# Altium schematic sheet LOAD.SchDoc
size A2; Author: Van Hieu; Organization: BACH-KHOA-DK; Gmail: maivanhieu24042003@gmail.com
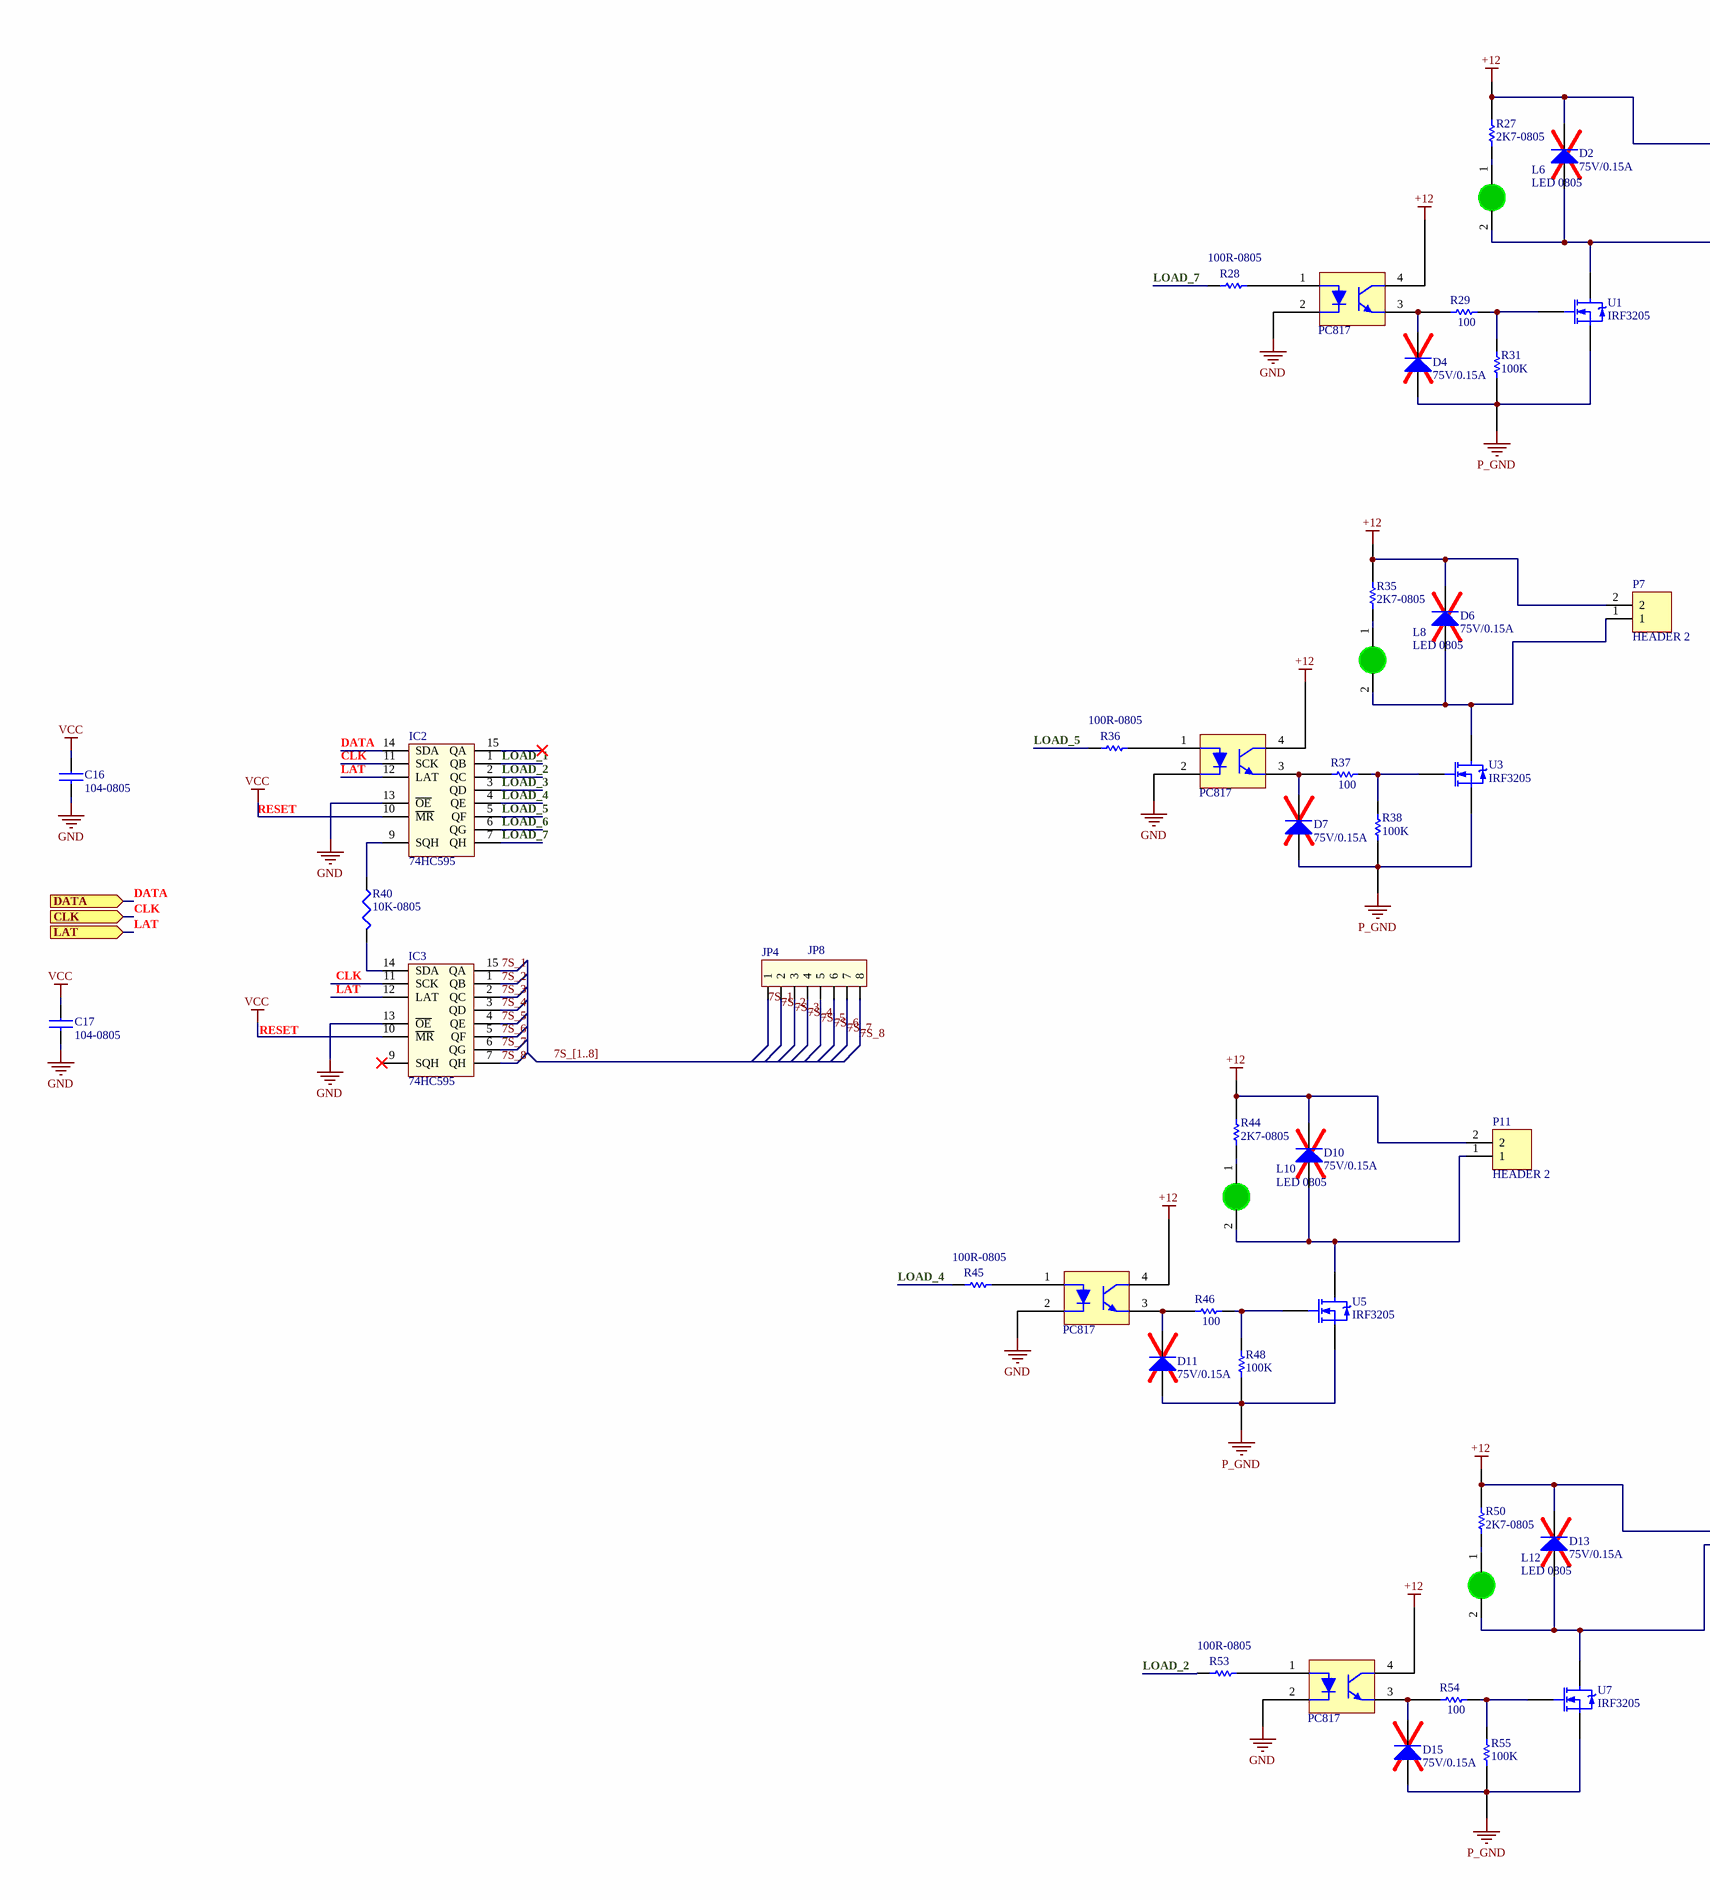
[diagram p0: LOAD.SchDoc, left]
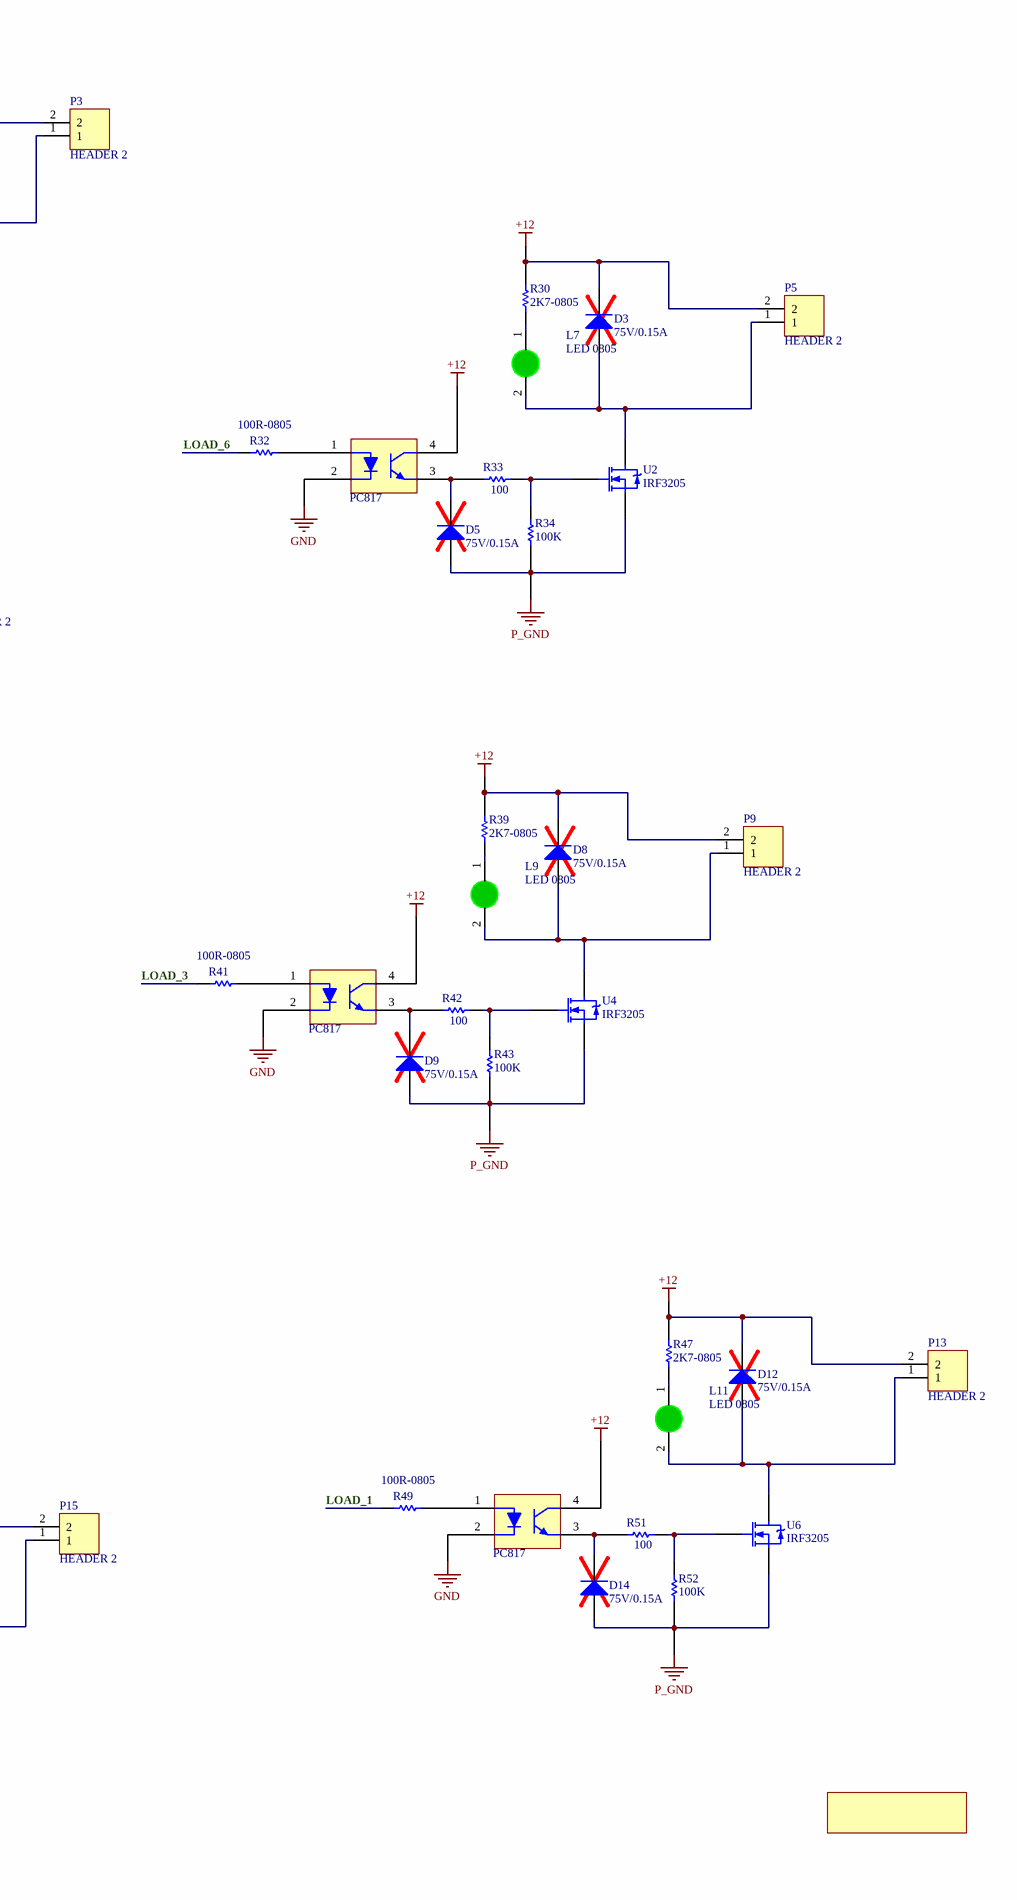
[diagram p1: LOAD.SchDoc, right]

## Parts
C16  104-0805  [CAP0805]
C17  104-0805  [CAP0805]
D2  75V/0.15A  [DIO-SOD232-1.15H]
D3  75V/0.15A  [DIO-SOD232-1.15H]
D4  75V/0.15A  [DIO-SOD232-1.15H]
D5  75V/0.15A  [DIO-SOD232-1.15H]
D6  75V/0.15A  [DIO-SOD232-1.15H]
D7  75V/0.15A  [DIO-SOD232-1.15H]
D8  75V/0.15A  [DIO-SOD232-1.15H]
D9  75V/0.15A  [DIO-SOD232-1.15H]
D10  75V/0.15A  [DIO-SOD232-1.15H]
D11  75V/0.15A  [DIO-SOD232-1.15H]
D12  75V/0.15A  [DIO-SOD232-1.15H]
D13  75V/0.15A  [DIO-SOD232-1.15H]
D14  75V/0.15A  [DIO-SOD232-1.15H]
D15  75V/0.15A  [DIO-SOD232-1.15H]
IC2  74HC595  [HC595_SOP127P600X175-16N]
IC3  74HC595  [HC595_SOP127P600X175-16N]
JP4  JP8  [CON8]
L6  LED 0805  [LED-GREEN-0805]
L7  LED 0805  [LED-GREEN-0805]
L8  LED 0805  [LED-GREEN-0805]
L9  LED 0805  [LED-GREEN-0805]
L10  LED 0805  [LED-GREEN-0805]
L11  LED 0805  [LED-GREEN-0805]
L12  LED 0805  [LED-GREEN-0805]
P3  HEADER 2  [HT508R-2P]
P4  PC817  [DIP-4]
P5  HEADER 2  [HT508R-2P]
P6  PC817  [DIP-4]
P7  HEADER 2  [HT508R-2P]
P8  PC817  [DIP-4]
P9  HEADER 2  [HT508R-2P]
P10  PC817  [DIP-4]
P11  HEADER 2  [HT508R-2P]
P12  PC817  [DIP-4]
P13  HEADER 2  [HT508R-2P]
P14  PC817  [DIP-4]
P15  HEADER 2  [HT508R-2P]
P16  PC817  [DIP-4]
R27  2K7-0805  [RESC2012L]
R28  100R-0805  [RESC2012L]
R29  100  [Res 0805 SMD]
R30  2K7-0805  [RESC2012L]
R31  100K  [Res 0805 SMD]
R32  100R-0805  [RESC2012L]
R33  100  [Res 0805 SMD]
R34  100K  [Res 0805 SMD]
R35  2K7-0805  [RESC2012L]
R36  100R-0805  [RESC2012L]
R37  100  [Res 0805 SMD]
R38  100K  [Res 0805 SMD]
R39  2K7-0805  [RESC2012L]
R40  10K-0805  [RES0805]
R41  100R-0805  [RESC2012L]
R42  100  [Res 0805 SMD]
R43  100K  [Res 0805 SMD]
R44  2K7-0805  [RESC2012L]
R45  100R-0805  [RESC2012L]
R46  100  [Res 0805 SMD]
R47  2K7-0805  [RESC2012L]
R48  100K  [Res 0805 SMD]
R49  100R-0805  [RESC2012L]
R50  2K7-0805  [RESC2012L]
R51  100  [Res 0805 SMD]
R52  100K  [Res 0805 SMD]
R53  100R-0805  [RESC2012L]
R54  100  [Res 0805 SMD]
R55  100K  [Res 0805 SMD]
U1  IRF3205  [TO-220]
U2  IRF3205  [TO-220]
U3  IRF3205  [TO-220]
U4  IRF3205  [TO-220]
U5  IRF3205  [TO-220]
U6  IRF3205  [TO-220]
U7  IRF3205  [TO-220]

## Ports
CLK (in), DATA (in), LAT (in)

## Nets
+12: D2.2(K) D3.2(K) D6.2(K) D8.2(K) D10.2(K) D12.2(K) D13.2(K) P3.2 P4.4 P5.2 P6.4 P7.2 P8.4 P9.2 P10.4 P11.2 P12.4 P13.2 P14.4 P15.2 P16.4 R27.2 R30.2 R35.2 R39.2 R44.2 R47.2 R50.2
GND: C16.2 C17.2 IC2.8(GND) IC2.13(~{OE}) IC3.8(GND) IC3.13(~{OE}) P4.2 P6.2 P8.2 P10.2 P12.2 P14.2 P16.2
P_GND: D4.1(A) D5.1(A) D7.1(A) D9.1(A) D11.1(A) D14.1(A) D15.1(A) R31.1 R34.1 R38.1 R43.1 R48.1 R52.1 R55.1 U1.3(S) U2.3(S) U3.3(S) U4.3(S) U5.3(S) U6.3(S) U7.3(S)
VCC: C16.1 C17.1 IC2.10(~{MR}) IC2.16(VCC) IC3.10(~{MR}) IC3.16(VCC)
7S_1: IC3.15(QA) JP4.1
7S_2: IC3.1(QB) JP4.2
7S_3: IC3.2(QC) JP4.3
7S_4: IC3.3(QD) JP4.4
7S_5: IC3.4(QE) JP4.5
7S_6: IC3.5(QF) JP4.6
7S_7: IC3.6(QG) JP4.7
7S_8: IC3.7(QH) JP4.8
CLK: IC2.11(SCK) IC3.11(SCK) ; port CLK
DATA: IC2.14(SDA) ; port DATA
LAT: IC2.12(LAT) IC3.12(LAT) ; port LAT
LOAD_1: IC2.1(QB) R49.2
LOAD_2: IC2.2(QC) R53.2
LOAD_3: IC2.3(QD) R41.2
LOAD_4: IC2.4(QE) R45.2
LOAD_5: IC2.5(QF) R36.2
LOAD_6: IC2.6(QG) R32.2
LOAD_7: IC2.7(QH) R28.2
NetD2_1: D2.1(A) L6.2(K) P3.1 U1.2(D)
NetD3_1: D3.1(A) L7.2(K) P5.1 U2.2(D)
NetD4_2: D4.2(K) P4.3 R29.2
NetD5_2: D5.2(K) P6.3 R33.2
NetD6_1: D6.1(A) L8.2(K) P7.1 U3.2(D)
NetD7_2: D7.2(K) P8.3 R37.2
NetD8_1: D8.1(A) L9.2(K) P9.1 U4.2(D)
NetD9_2: D9.2(K) P10.3 R42.2
NetD10_1: D10.1(A) L10.2(K) P11.1 U5.2(D)
NetD11_2: D11.2(K) P12.3 R46.2
NetD12_1: D12.1(A) L11.2(K) P13.1 U6.2(D)
NetD13_1: D13.1(A) L12.2(K) P15.1 U7.2(D)
NetD14_2: D14.2(K) P14.3 R51.2
NetD15_2: D15.2(K) P16.3 R54.2
NetIC2_9: IC2.9(SQH) R40.1
NetIC3_14: IC3.14(SDA) R40.2
NetL6_1: L6.1(A) R27.1
NetL7_1: L7.1(A) R30.1
NetL8_1: L8.1(A) R35.1
NetL9_1: L9.1(A) R39.1
NetL10_1: L10.1(A) R44.1
NetL11_1: L11.1(A) R47.1
NetL12_1: L12.1(A) R50.1
NetP4_1: P4.1 R28.1
NetP6_1: P6.1 R32.1
NetP8_1: P8.1 R36.1
NetP10_1: P10.1 R41.1
NetP12_1: P12.1 R45.1
NetP14_1: P14.1 R49.1
NetP16_1: P16.1 R53.1
NetR29_1: R29.1 R31.2 U1.1(G)
NetR33_1: R33.1 R34.2 U2.1(G)
NetR37_1: R37.1 R38.2 U3.1(G)
NetR42_1: R42.1 R43.2 U4.1(G)
NetR46_1: R46.1 R48.2 U5.1(G)
NetR51_1: R51.1 R52.2 U6.1(G)
NetR54_1: R54.1 R55.2 U7.1(G)

Not connected (* = marked no-connect by the designer): IC2 15(QA)*; IC3 9(SQH)*

## Buses and harness runs
bus 7S_[1..8]

## Notes on the sheet
- RESET
- Van Hieu
- Date:
- File:
- Size:
- A3
- Number:
- Time:
- Sheet
- Revision:
- of
- BK-DN
- maivanhieu24042003@gmail.com

## Library data of the parts
C16 C17 = CC0805JRNPO9BN200: Multilayer Ceramic Capacitors MLCC - SMD/SMT 20pF 50V NPO 5%; Manufacturer: Yageo; Type: General Purpose Surface-Mount Ceramic Multilayer Capacitor; Voltage Rating DC: 50 VDC; Class: Class 1; Dielectric: C0G (NP0); Supplier 1: Mouser; Manufacturer Part Number: CC0805JRNPO9BN200; RoHS: RoHS Compliant By Exemption; Category: Multilayer Ceramic Capacitors MLCC - SMD/SMT; Stock 1: 0; Pricing 1: 1=0.100, 10=0.040, 100=0.018, 1000=0.014, 4000=0.013 (USD); Capacitance: 20 pF; Length: 2 mm; Package / Case: 0805 (2012 metric); Packaging: Cut Tape; Product: General Type MLCCs; Series: CC; Termination Style: SMD/SMT; Tolerance: 5 %; Width: 1.25 mm; Brand: Yageo; Case Code - in: 0805; Case Code - mm: 2012; Maximum Operating Temperature: + 125 C; Minimum Operating Temperature: - 55 C; Product Type: Ceramic Capacitors; Standard Pack Qty: 4000; Subcategory: Capacitors; Termination: Standard; RoHS - Mouser: E; Minimum Order Quantity: 1; Reeling: True; ComponentLink1URL: http://www.mouser.com/datasheet/2/447/UPY-GP_NP0_16V-to-50V_16-1109089.pdf; ComponentLink1Description: http://www.mouser.com/datasheet/2/447/UPY-GP_NP0_16V-to-50V_16-1109089.pdf; Supplier Part Number 1: 603-CC805JRNPO9BN200
D2-D15 = 1N4148WS: DIO GEN 75V 0.15A SOD323 SMD; MFR: ONSEMI; UNIT: PCS; MFR PN: 1N4148WS; LINK: NA; PRICE: NA
IC2 IC3 = 74595: 8 Bit Serial input - Parallel Output; Value: 74HC595
JP4 = Con8: Connector 8; Value: Connector 8
L6-L12 = LED GREEN 0805: SMD; Don_Vi: Con; Chung_Loai: Dán; Ma_Hang: MH000897; Ten_Linh_Kien: LED 0805 Màu Đỏ (Red); Ghi_Chu: *; Kieu_Chan: *
P4 P6 P8 P10 P12 P14 P16 = PC817: NPN PHOTO General Purpose Amplifier; Published: 8-Jun-2000; LatestRevisionDate: 15-Jan-2003; LatestRevisionNote: PCB Footprint 'BCY-W3/D4.7' replaced; DatasheetDocument: 1997; PackageReference: TO-92A; Publisher: Altium Limited; Code_JEDEC: TO-92A
R27-R39 R41-R55 = 34.8K/R0805/1%_3: 1 kOhms ±1% 0.125W, 1/8W Chip Resistor 0805 (2012 Metric) Automotive AEC-Q200 Thick Film; Power Rating: 100mW; Resistance: 34.8kR; Voltage Rating: 50V; Case/Package: 0603; Case Code (Imperial): 0603; Case Code (Metric): 1608; Min Operating Temperature: -55°C; Max Operating Temperature: 155°C; Termination: SMD/SMT; Military Standard: Not; Voltage Rating (DC): 50V; Length: 1.6mm; Height: 0.45mm; Width: 0.8mm; Depth: 0.8mm; Lead Free: Lead Free; Digikey: 541-1.00KCCT-ND
R40 = RC0805JR-0710KL: RES SMD 10K OHM 5% 1/8W 0805; Manufacturer: Yageo; Power (Watts): 0.125W, 1/8W; Temperature Coefficient: ±100ppm/°C; Supplier 1: Digi-Key; Manufacturer Part Number: RC0805JR-0710KL; RoHS: RoHS Compliant; Category: Resistors; Stock 1: 0; Pricing 1: 1=0.1, 10=0.036, 100=0.0145, 1000=0.00652, 2500=0.00566 (USD); Packaging: Cut Tape (CT); Part Status: Active; Tolerance: ±5%; Composition: Thick Film; Features: Moisture Resistant; Operating Temperature: -55°C ~ 155°C; Package / Case: 0805 (2012 Metric); Supplier Device Package: 0805; Size / Dimension: 0.079" L x 0.049" W (2.00mm x 1.25mm); Height - Seated (Max): 0.024" (0.60mm); Failure Rate: -; ComponentLink1URL: http://www.yageo.com/documents/recent/PYu-RC_Group_51_RoHS_L_9.pdf; ComponentLink1Description: http://www.yageo.com/documents/recent/PYu-RC_Group_51_RoHS_L_9.pdf; Supplier Part Number 1: 311-10KARCT-ND
U1-U7 = IRF3205: MOSFET N-CH 55V 110A TO-220AB